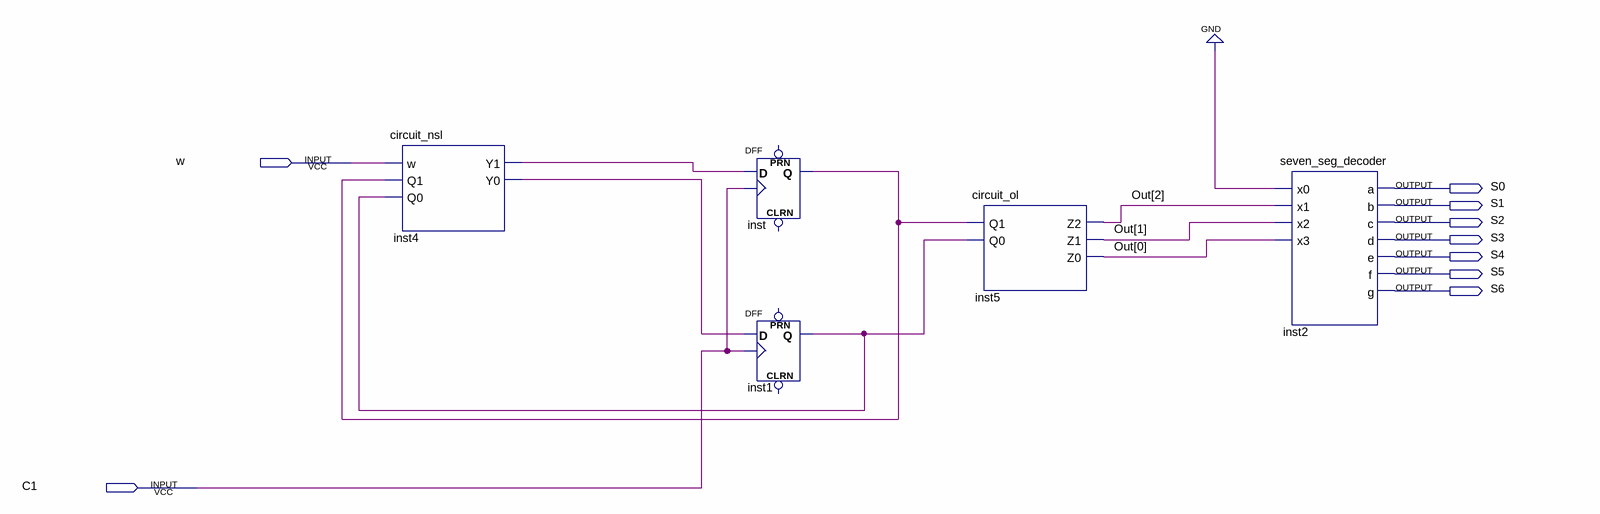
[diagram p0: schematic sheet]
// Quartus schematic lab11step2.bdf as structural Verilog: 5 symbols, 9 pins
module lab11step2 (
  input  w,
  input  C1,
  output S0,
  output S1,
  output S2,
  output S3,
  output S4,
  output S5,
  output S6
);

  wire inst1_q, inst4_y0, inst4_y1, inst_q;
  wire [2:0] Out;

  circuit_nsl inst4 (.w(w), .Q1(inst_q), .Q0(inst1_q), .Y1(inst4_y1), .Y0(inst4_y0));
  DFF inst (.CLK(C1), .D(inst4_y1), .Q(inst_q));  // open: CLRN, PRN
  DFF inst1 (.CLK(C1), .D(inst4_y0), .Q(inst1_q));  // open: CLRN, PRN
  circuit_ol inst5 (.Q1(inst_q), .Q0(inst1_q), .Z2(Out[2]), .Z1(Out[1]), .Z0(Out[0]));
  seven_seg_decoder inst2 (
    .x0(1'b0), .x1(Out[2]), .x2(Out[1]), .x3(Out[0]), .a(S0), .b(S1), .c(S2), .d(S3), .e(S4), .f(S5), .g(S6));
endmodule
